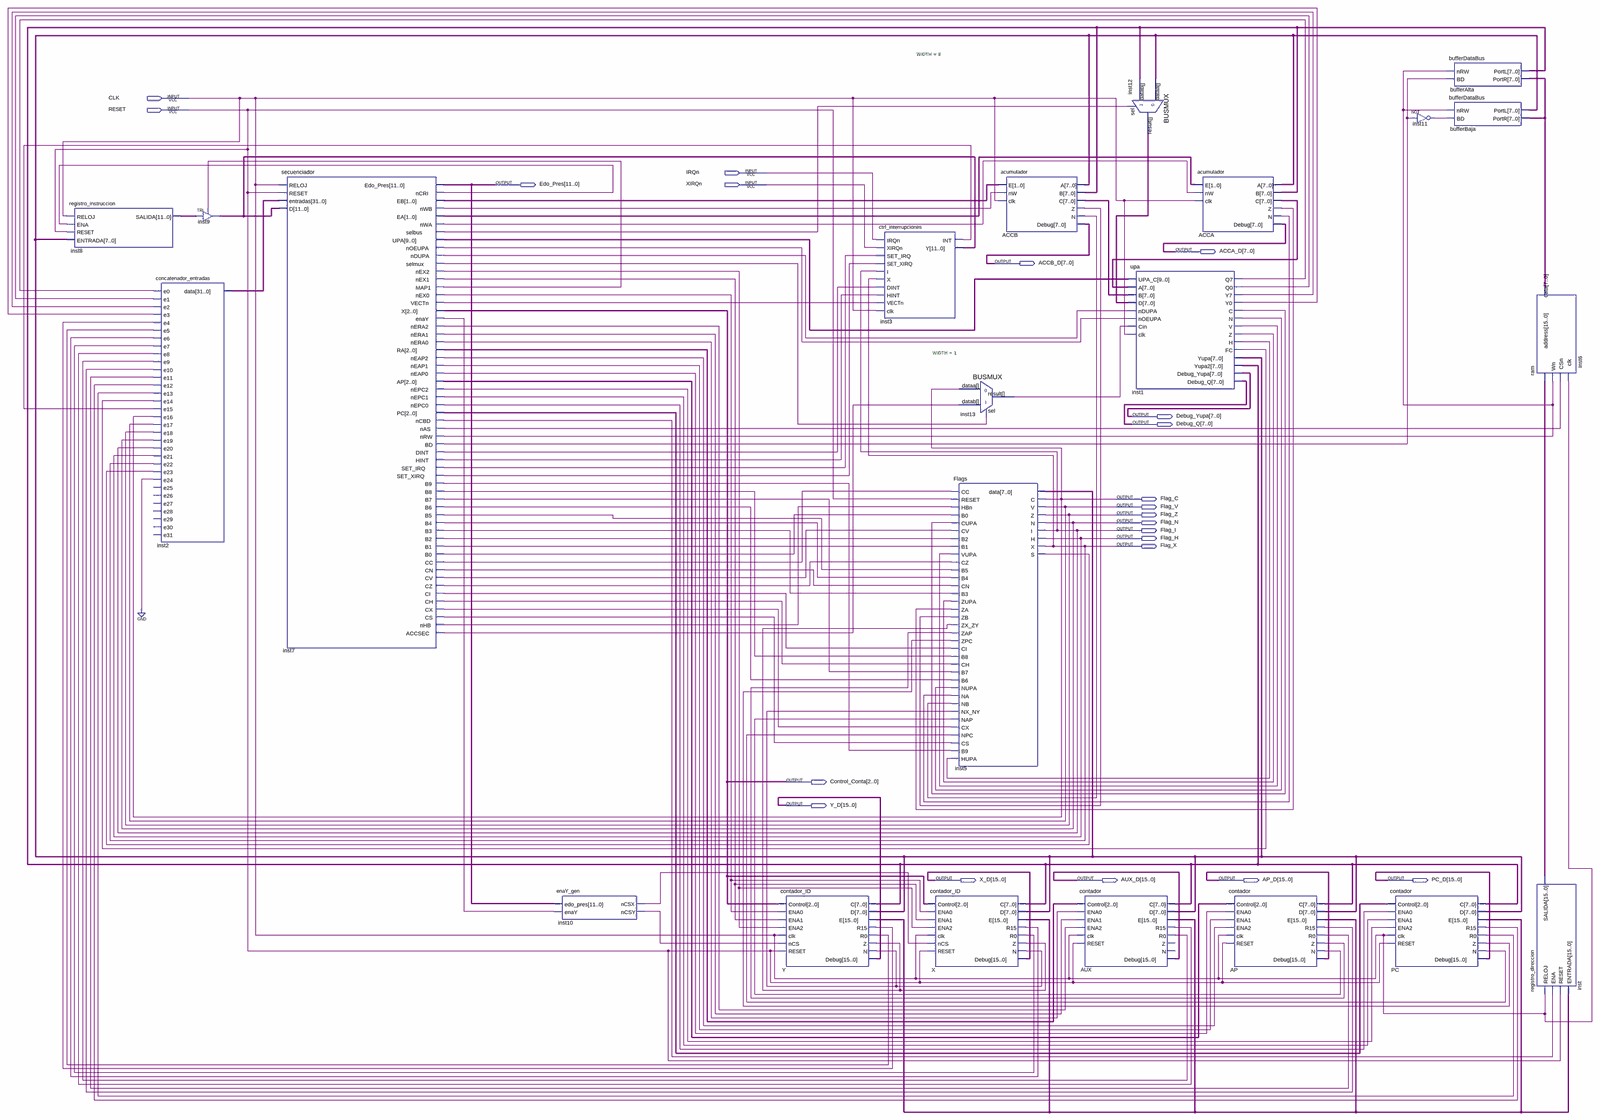
[diagram p0: schematic sheet, whole]
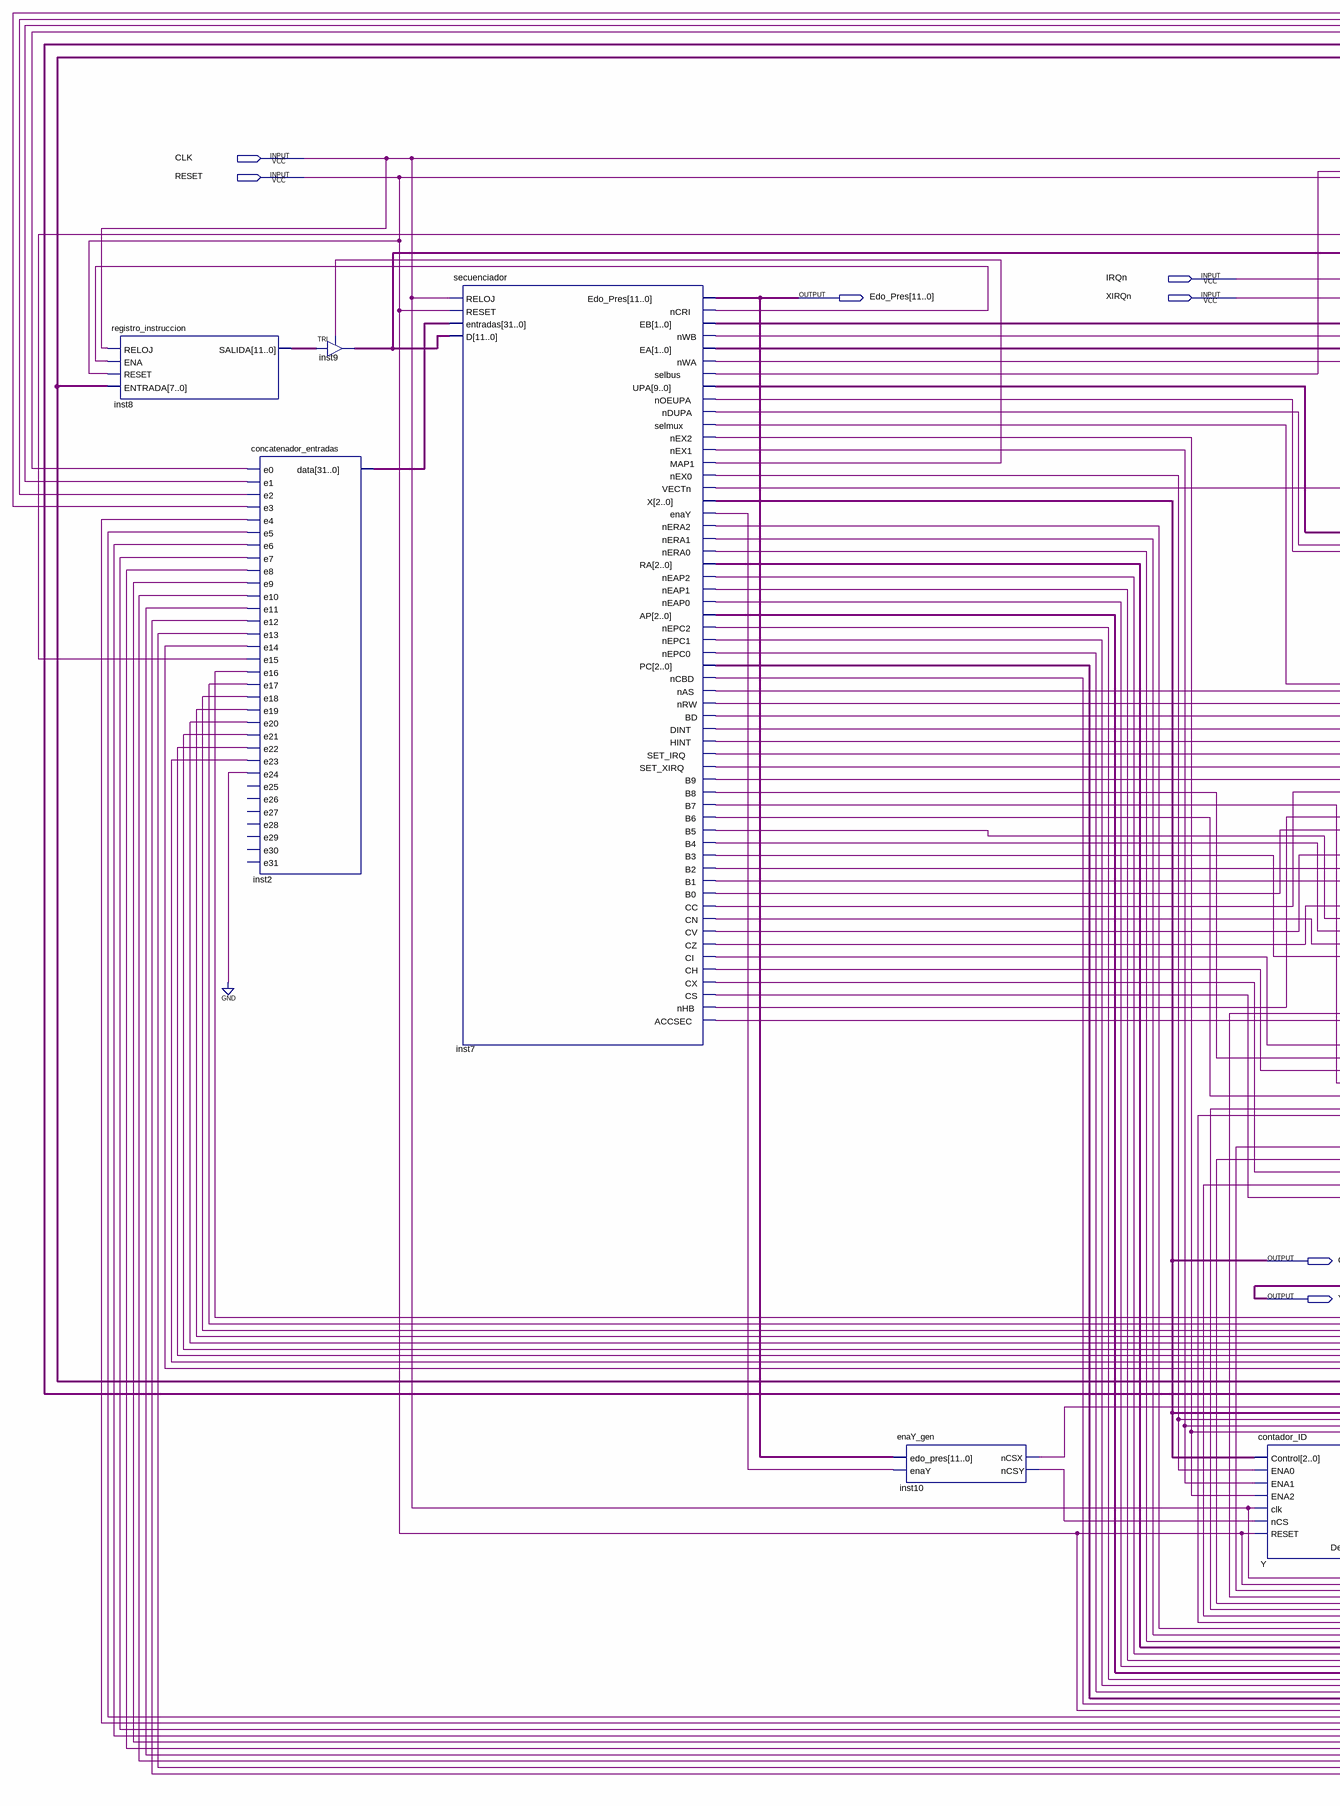
[diagram p1: schematic sheet, left part]
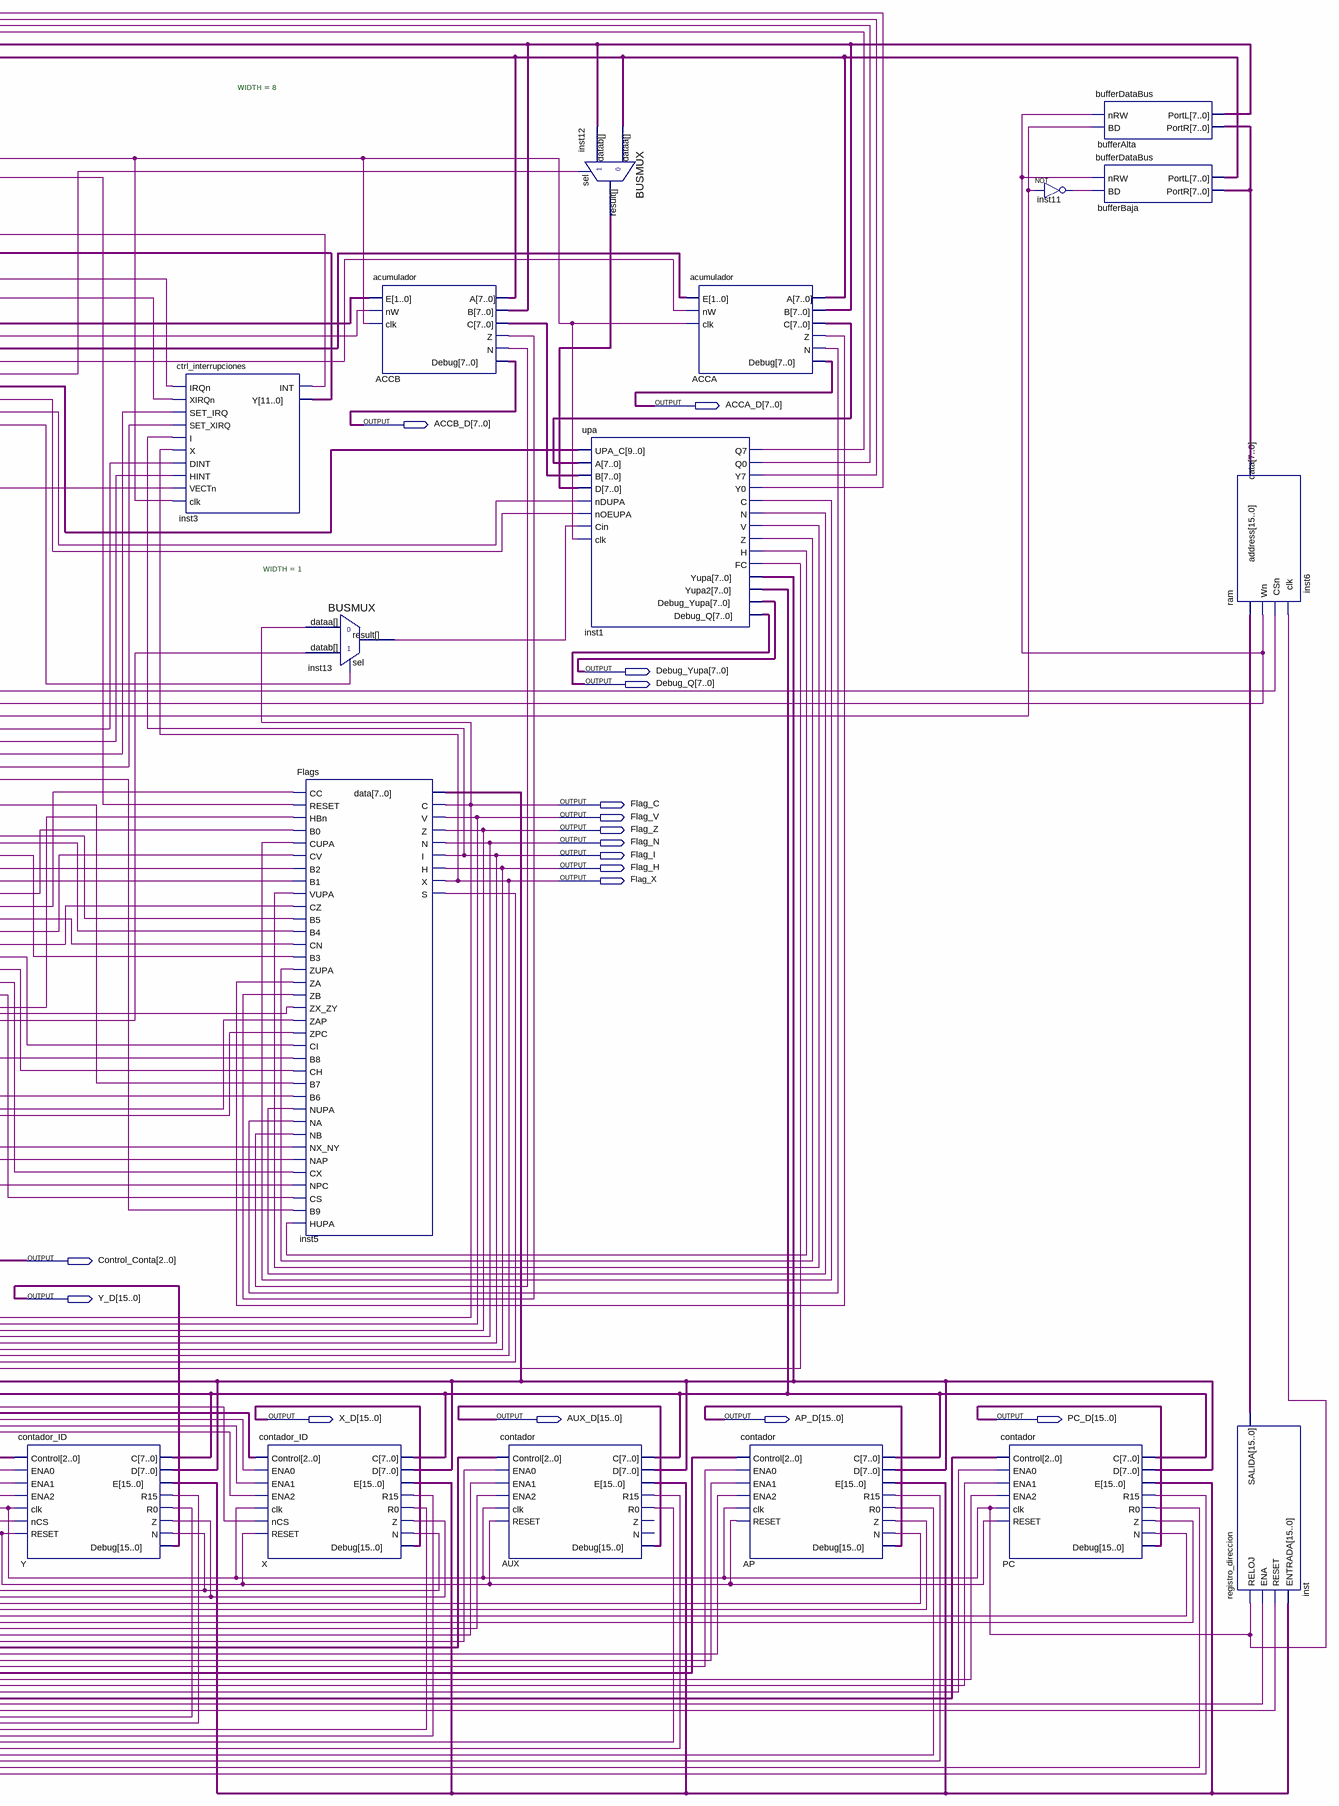
[diagram p2: schematic sheet, right part]
// Quartus schematic m68hc11.bdf as structural Verilog: 22 symbols, 22 pins
module m68hc11 (
  input  CLK,
  input  RESET,
  input  IRQn,
  input  XIRQn,
  output [11:0] Edo_Pres,
  output [7:0] ACCA_D,
  output [7:0] ACCB_D,
  output [7:0] Debug_Yupa,
  output [7:0] Debug_Q,
  output Flag_C,
  output Flag_V,
  output Flag_Z,
  output Flag_N,
  output Flag_I,
  output Flag_H,
  output Flag_X,
  output [2:0] Control_Conta,
  output [15:0] Y_D,
  output [15:0] X_D,
  output [15:0] AUX_D,
  output [15:0] AP_D,
  output [15:0] PC_D
);

  wire ACCA_n, ACCA_z, ACCB_n, ACCB_z, AP_n, AP_r0, AP_r15, AP_z, AUX_r0, AUX_r15, inst1_c, inst1_fc,
       inst1_h, inst1_n, inst1_q0, inst1_q7, inst1_v, inst1_y0, inst1_y7, inst1_z, inst3_int, inst5_s,
       inst7_accsec, inst7_b0, inst7_b1, inst7_b2, inst7_b3, inst7_b4, inst7_b5, inst7_b6, inst7_b7,
       inst7_b8, inst7_b9, inst7_bd, inst7_cc, inst7_ch, inst7_ci, inst7_cn, inst7_cs, inst7_cv, inst7_cx,
       inst7_cz, inst7_dint, inst7_enay, inst7_hint, inst7_map1, inst7_nas, inst7_ncbd, inst7_ncri,
       inst7_ndupa, inst7_neap0, inst7_neap1, inst7_neap2, inst7_nepc0, inst7_nepc1, inst7_nepc2,
       inst7_nera0, inst7_nera1, inst7_nera2, inst7_nex0, inst7_nex1, inst7_nex2, inst7_nhb, inst7_noeupa,
       inst7_nrw, inst7_nwa, inst7_nwb, inst7_selbus, inst7_selmux, inst7_set_irq, inst7_set_xirq,
       inst7_vectn, inst10_ncsx, inst10_ncsy, inst11_out, inst13_result, PC_n, PC_r0, PC_r15, PC_z, X_r0,
       X_r15, Y_n, Y_r0, Y_r15, Y_z;
  wire [1:0] inst7_ea, inst7_eb;
  wire [2:0] inst7_ap, inst7_pc, inst7_ra;
  wire [7:0] ACCA_c, ACCB_c, bufferAlta_portr, inst12_result, Y_c, Y_d_2;
  wire [9:0] inst7_upa;
  wire [11:0] inst8_salida, inst9_out;
  wire [15:0] inst_salida, Y_e;
  wire [31:0] inst2_data;

  registro_instruccion inst8 (.RELOJ(CLK), .ENA(inst7_ncri), .RESET(RESET), .ENTRADA(Y_d_2), .SALIDA(inst8_salida));
  concatenador_entradas inst2 (
    .e0(inst1_q7), .e1(inst1_q0), .e2(inst1_y7), .e3(inst1_y0), .e4(Y_r15), .e5(Y_r0), .e6(X_r15), .e7(X_r0),
    .e8(AUX_r15), .e9(AUX_r0), .e10(AP_r15), .e11(AP_r0), .e12(PC_r15), .e13(PC_r0), .e14(inst1_fc),
    .e15(inst3_int), .e16(Flag_C), .e17(Flag_V), .e18(Flag_Z), .e19(Flag_N), .e20(Flag_I), .e21(Flag_H),
    .e22(Flag_X), .e23(inst5_s), .e24(1'b0), .data(inst2_data));  // open: e25, e26, e27, e28, e29, e30, e31
  TRI inst9[11:0] (.IN(inst8_salida), .OE(inst7_map1), .OUT(inst9_out));
  secuenciador inst7 (
    .RELOJ(CLK), .RESET(RESET), .entradas(inst2_data), .D(inst9_out), .Edo_Pres(Edo_Pres), .nCRI(inst7_ncri),
    .EB(inst7_eb), .nWB(inst7_nwb), .EA(inst7_ea), .nWA(inst7_nwa), .selbus(inst7_selbus), .UPA(inst7_upa),
    .nOEUPA(inst7_noeupa), .nDUPA(inst7_ndupa), .selmux(inst7_selmux), .nEX2(inst7_nex2), .nEX1(inst7_nex1),
    .MAP1(inst7_map1), .nEX0(inst7_nex0), .VECTn(inst7_vectn), .X(Control_Conta), .enaY(inst7_enay),
    .nERA2(inst7_nera2), .nERA1(inst7_nera1), .nERA0(inst7_nera0), .RA(inst7_ra), .nEAP2(inst7_neap2),
    .nEAP1(inst7_neap1), .nEAP0(inst7_neap0), .AP(inst7_ap), .nEPC2(inst7_nepc2), .nEPC1(inst7_nepc1),
    .nEPC0(inst7_nepc0), .PC(inst7_pc), .nCBD(inst7_ncbd), .nAS(inst7_nas), .nRW(inst7_nrw), .BD(inst7_bd),
    .DINT(inst7_dint), .HINT(inst7_hint), .SET_IRQ(inst7_set_irq), .SET_XIRQ(inst7_set_xirq), .B9(inst7_b9),
    .B8(inst7_b8), .B7(inst7_b7), .B6(inst7_b6), .B5(inst7_b5), .B4(inst7_b4), .B3(inst7_b3), .B2(inst7_b2),
    .B1(inst7_b1), .B0(inst7_b0), .CC(inst7_cc), .CN(inst7_cn), .CV(inst7_cv), .CZ(inst7_cz), .CI(inst7_ci),
    .CH(inst7_ch), .CX(inst7_cx), .CS(inst7_cs), .nHB(inst7_nhb), .ACCSEC(inst7_accsec));
  enaY_gen inst10 (.edo_pres(Edo_Pres), .enaY(inst7_enay), .nCSX(inst10_ncsx), .nCSY(inst10_ncsy));
  contador_ID Y (
    .Control(Control_Conta), .ENA0(inst7_nex0), .ENA1(inst7_nex1), .ENA2(inst7_nex2), .clk(CLK),
    .nCS(inst10_ncsy), .RESET(RESET), .E(Y_e), .Z(Y_z), .N(Y_n), .Debug(Y_D), .C(Y_c), .D(Y_d_2),
    .R15(Y_r15), .R0(Y_r0));
  ctrl_interrupciones inst3 (
    .IRQn(IRQn), .XIRQn(XIRQn), .SET_IRQ(inst7_set_irq), .SET_XIRQ(inst7_set_xirq), .I(Flag_I), .X(Flag_X),
    .DINT(inst7_dint), .HINT(inst7_hint), .VECTn(inst7_vectn), .clk(CLK), .INT(inst3_int), .Y(inst9_out));
  contador_ID X (
    .Control(Control_Conta), .ENA0(inst7_nex0), .ENA1(inst7_nex1), .ENA2(inst7_nex2), .clk(CLK),
    .nCS(inst10_ncsx), .RESET(RESET), .E(Y_e), .Z(Y_z), .N(Y_n), .Debug(X_D), .C(Y_c), .D(Y_d_2),
    .R15(X_r15), .R0(X_r0));
  BUSMUX #(.WIDTH(1)) inst13 (.datab(inst7_accsec), .sel(inst7_selmux), .dataa(Flag_C), .result(inst13_result));
  Flags inst5 (
    .CC(inst7_cc), .RESET(RESET), .HBn(inst7_nhb), .B0(inst7_b0), .CUPA(inst1_c), .CV(inst7_cv),
    .B2(inst7_b2), .B1(inst7_b1), .VUPA(inst1_v), .CZ(inst7_cz), .B5(inst7_b5), .B4(inst7_b4), .CN(inst7_cn),
    .B3(inst7_b3), .ZUPA(inst1_z), .ZA(ACCA_z), .ZB(ACCB_z), .ZX_ZY(Y_z), .ZAP(AP_z), .ZPC(PC_z),
    .CI(inst7_ci), .B8(inst7_b8), .CH(inst7_ch), .B7(inst7_b7), .B6(inst7_b6), .NUPA(inst1_n), .NA(ACCA_n),
    .NB(ACCB_n), .NX_NY(Y_n), .NAP(AP_n), .CX(inst7_cx), .NPC(PC_n), .CS(inst7_cs), .B9(inst7_b9),
    .HUPA(inst1_h), .C(Flag_C), .V(Flag_V), .Z(Flag_Z), .N(Flag_N), .I(Flag_I), .H(Flag_H), .X(Flag_X),
    .S(inst5_s), .data(Y_d_2));
  acumulador ACCB (
    .E(inst7_eb), .nW(inst7_nwb), .clk(CLK), .Z(ACCB_z), .N(ACCB_n), .Debug(ACCB_D), .A(Y_d_2), .B(Y_c),
    .C(ACCB_c));
  contador AUX (
    .Control(inst7_ra), .ENA0(inst7_nera0), .ENA1(inst7_nera1), .ENA2(inst7_nera2), .clk(CLK), .RESET(RESET),
    .E(Y_e), .Debug(AUX_D), .C(Y_c), .D(Y_d_2), .R15(AUX_r15), .R0(AUX_r0));  // open: Z, N
  BUSMUX #(.WIDTH(8)) inst12 (.datab(Y_c), .sel(inst7_selbus), .dataa(Y_d_2), .result(inst12_result));
  upa inst1 (
    .UPA_C(inst7_upa), .A(ACCA_c), .B(ACCB_c), .D(inst12_result), .nDUPA(inst7_ndupa), .nOEUPA(inst7_noeupa),
    .Cin(inst13_result), .clk(CLK), .Q7(inst1_q7), .Q0(inst1_q0), .Y7(inst1_y7), .Y0(inst1_y0), .C(inst1_c),
    .N(inst1_n), .V(inst1_v), .Z(inst1_z), .H(inst1_h), .FC(inst1_fc), .Yupa(Y_d_2), .Yupa2(Y_c),
    .Debug_Yupa(Debug_Yupa), .Debug_Q(Debug_Q));
  acumulador ACCA (
    .E(inst7_ea), .nW(inst7_nwa), .clk(CLK), .Z(ACCA_z), .N(ACCA_n), .Debug(ACCA_D), .A(Y_d_2), .B(Y_c),
    .C(ACCA_c));
  contador AP (
    .Control(inst7_ap), .ENA0(inst7_neap0), .ENA1(inst7_neap1), .ENA2(inst7_neap2), .clk(CLK), .RESET(RESET),
    .E(Y_e), .Z(AP_z), .N(AP_n), .Debug(AP_D), .C(Y_c), .D(Y_d_2), .R15(AP_r15), .R0(AP_r0));
  not inst11 (inst11_out, inst7_bd);
  contador PC (
    .Control(inst7_pc), .ENA0(inst7_nepc0), .ENA1(inst7_nepc1), .ENA2(inst7_nepc2), .clk(CLK), .RESET(RESET),
    .E(Y_e), .Z(PC_z), .N(PC_n), .Debug(PC_D), .C(Y_c), .D(Y_d_2), .R15(PC_r15), .R0(PC_r0));
  bufferDataBus bufferAlta (.nRW(inst7_nrw), .BD(inst7_bd), .PortL(Y_c), .PortR(bufferAlta_portr));
  bufferDataBus bufferBaja (.nRW(inst7_nrw), .BD(inst11_out), .PortL(Y_d_2), .PortR(bufferAlta_portr));
  ram inst6 (.address(inst_salida), .Wn(inst7_nrw), .CSn(inst7_nas), .clk(CLK), .data(bufferAlta_portr));
  registro_direccion inst (.RELOJ(CLK), .ENA(inst7_ncbd), .RESET(RESET), .ENTRADA(Y_e), .SALIDA(inst_salida));
endmodule
